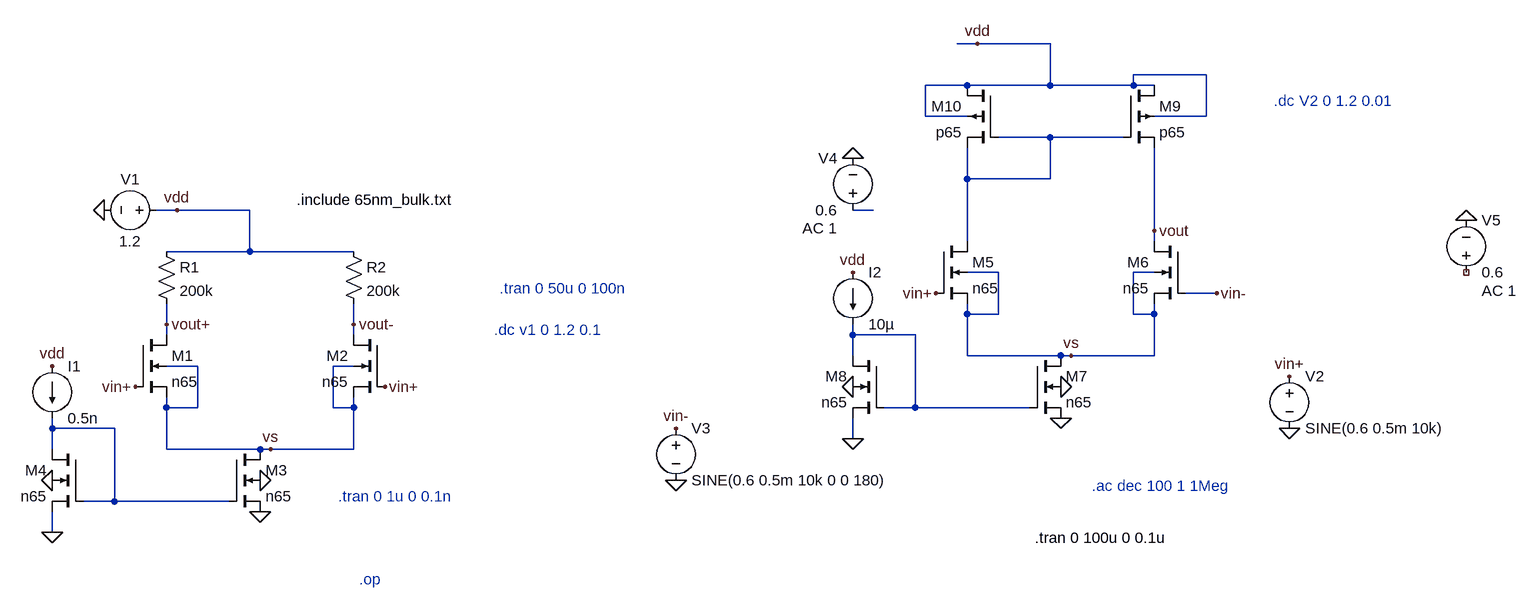
[diagram p0: schematic differential_amp.asc]
differential_amp.asc, the LTspice schematic file:
Version 4.1
SHEET 1 2176 680
WIRE 1344 -224 1312 -224
WIRE 1456 -224 1344 -224
WIRE 1696 -176 1584 -176
WIRE 1328 -160 1264 -160
WIRE 1456 -160 1456 -224
WIRE 1456 -160 1328 -160
WIRE 1584 -160 1584 -176
WIRE 1584 -160 1456 -160
WIRE 1616 -160 1584 -160
WIRE 1264 -112 1264 -160
WIRE 1328 -112 1264 -112
WIRE 1696 -112 1696 -176
WIRE 1696 -112 1616 -112
WIRE 1456 -80 1376 -80
WIRE 1568 -80 1456 -80
WIRE 1328 -16 1328 -64
WIRE 1456 -16 1456 -80
WIRE 1456 -16 1328 -16
WIRE 112 32 80 32
WIRE 224 32 112 32
WIRE 1184 32 1152 32
WIRE 1616 64 1616 -64
WIRE 1328 80 1328 -16
WIRE 1616 80 1616 64
WIRE 224 96 224 32
WIRE 224 96 96 96
WIRE 384 96 224 96
WIRE 1376 128 1328 128
WIRE 1616 128 1584 128
WIRE 1712 160 1664 160
WIRE 1328 192 1328 176
WIRE 1376 192 1376 128
WIRE 1376 192 1328 192
WIRE 1584 192 1584 128
WIRE 1616 192 1616 176
WIRE 1616 192 1584 192
WIRE 96 208 96 176
WIRE 384 208 384 176
WIRE 96 224 96 208
WIRE 384 224 384 208
WIRE 1152 224 1152 208
WIRE 1248 224 1152 224
WIRE 1152 256 1152 224
WIRE 1328 256 1328 192
WIRE 1472 256 1328 256
WIRE 1488 256 1472 256
WIRE 1616 256 1616 192
WIRE 1616 256 1488 256
WIRE 144 272 96 272
WIRE 384 272 352 272
WIRE 96 336 96 320
WIRE 144 336 144 272
WIRE 144 336 96 336
WIRE 352 336 352 272
WIRE 384 336 384 320
WIRE 384 336 352 336
WIRE 1248 336 1248 224
WIRE 1248 336 1200 336
WIRE 1424 336 1248 336
WIRE -80 368 -80 352
WIRE 16 368 -80 368
WIRE 1152 384 1152 352
WIRE -80 400 -80 368
WIRE 96 400 96 336
WIRE 240 400 96 400
WIRE 256 400 240 400
WIRE 384 400 384 336
WIRE 384 400 256 400
WIRE 16 480 16 368
WIRE 16 480 -32 480
WIRE 192 480 16 480
WIRE -80 528 -80 496
FLAG 0 32 0
FLAG 240 496 0
FLAG 240 448 0
FLAG -80 528 0
FLAG -80 448 0
FLAG 112 32 vdd
FLAG -80 272 vdd
FLAG 1824 288 vin+
FLAG 48 304 vin+
FLAG 880 368 vin-
FLAG 96 208 vout+
FLAG 384 208 vout-
FLAG 1824 368 0
FLAG 880 448 0
FLAG 256 400 vs
FLAG 432 304 vin+
FLAG 1472 352 0
FLAG 1472 304 0
FLAG 1152 384 0
FLAG 1152 304 0
FLAG 1344 -224 vdd
FLAG 1152 128 vdd
FLAG 1616 64 vout
FLAG 1488 256 vs
FLAG 1152 -48 0
FLAG 2096 48 0
FLAG 1280 160 vin+
FLAG 1712 160 vin-
SYMBOL res 80 80 R0
SYMATTR InstName R1
SYMATTR Value 200k
SYMBOL res 368 80 R0
SYMATTR InstName R2
SYMATTR Value 200k
SYMBOL nmos4 48 224 R0
SYMATTR InstName M1
SYMATTR Value n65
SYMATTR Value2 l=180n w=10u
SYMBOL nmos4 432 224 M0
SYMATTR InstName M2
SYMATTR Value n65
SYMATTR Value2 l=180n w=10u
SYMBOL voltage 96 32 R90
WINDOW 0 -32 56 VBottom 2
WINDOW 3 32 56 VTop 2
WINDOW 123 0 0 Left 0
WINDOW 39 0 0 Left 0
SYMATTR InstName V1
SYMATTR Value 1.2
SYMBOL nmos4 192 400 R0
SYMATTR InstName M3
SYMATTR Value n65
SYMATTR Value2 l=300n w=20u
SYMBOL nmos4 -32 400 M0
SYMATTR InstName M4
SYMATTR Value n65
SYMATTR Value2 l=300n w=20u
SYMBOL current -80 272 R0
WINDOW 123 0 0 Left 0
WINDOW 39 0 0 Left 0
SYMATTR InstName I1
SYMATTR Value 0.5n
SYMBOL voltage 1824 272 R0
WINDOW 123 0 0 Left 0
WINDOW 39 0 0 Left 0
SYMATTR InstName V2
SYMATTR Value SINE(0.6 0.5m 10k)
SYMBOL voltage 880 352 R0
WINDOW 123 0 0 Left 0
WINDOW 39 0 0 Left 0
SYMATTR InstName V3
SYMATTR Value SINE(0.6 0.5m 10k 0 0 180)
SYMBOL nmos4 1280 80 R0
SYMATTR InstName M5
SYMATTR Value n65
SYMATTR Value2 l=180n w=10u
SYMBOL nmos4 1664 80 M0
SYMATTR InstName M6
SYMATTR Value n65
SYMATTR Value2 l=180n w=10u
SYMBOL nmos4 1424 256 R0
SYMATTR InstName M7
SYMATTR Value n65
SYMATTR Value2 l=300n w=20u
SYMBOL nmos4 1200 256 M0
SYMATTR InstName M8
SYMATTR Value n65
SYMATTR Value2 l=300n w=20u
SYMBOL current 1152 128 R0
WINDOW 123 0 0 Left 0
WINDOW 39 0 0 Left 0
SYMATTR InstName I2
SYMATTR Value 10µ
SYMBOL pmos4 1568 -160 R0
SYMATTR InstName M9
SYMATTR Value p65
SYMATTR Value2 l=180n w=5u
SYMBOL pmos4 1376 -160 M0
SYMATTR InstName M10
SYMATTR Value p65
SYMATTR Value2 l=180n w=5u
SYMBOL voltage 1152 48 R180
WINDOW 0 24 96 Left 2
WINDOW 3 24 16 Left 2
WINDOW 123 24 -12 Left 2
WINDOW 39 0 0 Left 0
SYMATTR InstName V4
SYMATTR Value 0.6
SYMATTR Value2 AC 1
SYMBOL voltage 2096 144 M180
WINDOW 0 24 96 Left 2
WINDOW 3 24 16 Left 2
WINDOW 123 24 -12 Left 2
WINDOW 39 0 0 Left 0
SYMATTR InstName V5
SYMATTR Value 0.6
SYMATTR Value2 AC 1
TEXT 360 472 Left 2 ;.tran 0 1u 0 0.1n
TEXT 296 16 Left 2 !.include 65nm_bulk.txt
TEXT 600 216 Left 2 ;.dc v1 0 1.2 0.1
TEXT 1800 -136 Left 2 ;.dc V2 0 1.2 0.01
TEXT 608 152 Left 2 ;.tran 0 50u 0 100n
TEXT 392 600 Left 2 ;.op
TEXT 1520 456 Left 2 ;.ac dec 100 1 1Meg
TEXT 1432 536 Left 2 !.tran 0 100u 0 0.1u

The netlist it stands for:
* differential_amp.asc
R1 vdd vout+ 200k
R2 vdd vout- 200k
M1 vout+ vin+ vs vs n65 l=180n w=10u
M2 vout- vin+ vs vs n65 l=180n w=10u
V1 vdd 0 1.2
M3 vs N004 0 0 n65 l=300n w=20u
M4 N004 N004 0 0 n65 l=300n w=20u
I1 vdd N004 0.5n
V2 vin+ 0 SINE(0.6 0.5m 10k)
V3 vin- 0 SINE(0.6 0.5m 10k 0 0 180)
M5 N001 vin+ vs vs n65 l=180n w=10u
M6 vout vin- vs vs n65 l=180n w=10u
M7 vs N003 0 0 n65 l=300n w=20u
M8 N003 N003 0 0 n65 l=300n w=20u
I2 vdd N003 10µ
M9 vdd N001 vout vdd p65 l=180n w=5u
M10 vdd N001 N001 vdd p65 l=180n w=5u
V4 N002 0 0.6 AC 1
V5 NC_01 0 0.6 AC 1
.model NMOS NMOS
.model PMOS PMOS
.lib standard.mos
* .tran 0 1u 0 0.1n
.include 65nm_bulk.txt
* .dc v1 0 1.2 0.1
* .dc V2 0 1.2 0.01
* .tran 0 50u 0 100n
* .op
* .ac dec 100 1 1Meg
.tran 0 100u 0 0.1u
.backanno
.end